# Altium schematic sheet ReceiverBlock.SchDoc
size A4
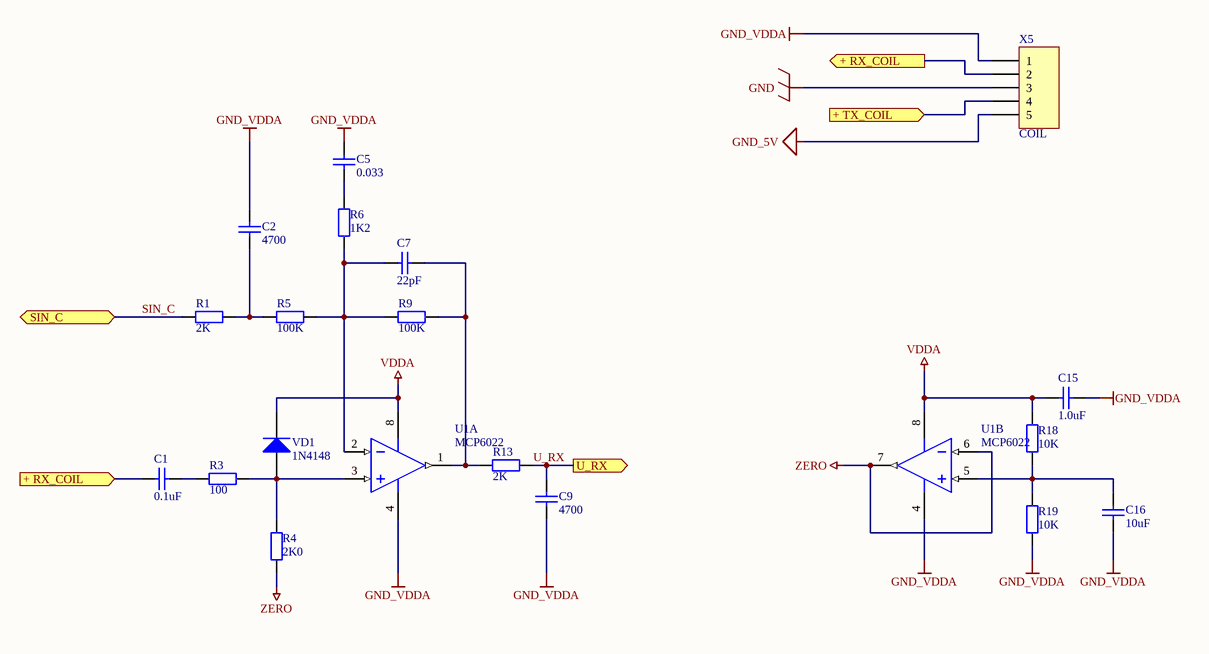
[diagram p0: ReceiverBlock.SchDoc]

## Parts
C1  0.1uF  [1206_SMD_Capacitor]
C2  4700  [1206_SMD_Capacitor]
C5  0.033  [1206_SMD_Capacitor]
C7  22pF  [1206_SMD_Capacitor]
C9  4700  [1206_SMD_Capacitor]
C15  1.0uF  [1206_SMD_Capacitor]
C16  10uF  [1206_SMD_Capacitor]
R1  2K  [1206_SMD_Resistor]
R3  100  [1206_SMD_Resistor]
R4  2K0  [1206_SMD_Resistor]
R5  100K  [1206_SMD_Resistor]
R6  1K2  [1206_SMD_Resistor]
R9  100K  [1206_SMD_Resistor]
R13  2K  [1206_SMD_Resistor]
R18  10K  [1206_SMD_Resistor]
R19  10K  [1206_SMD_Resistor]
U1  MCP6022  [SOIC-SN8_N]  (parts A,B of 2)
VD1  1N4148  [SOD-323]
X5  COIL  [GX16-5]

## Ports
+ RX_COIL (in), + RX_COIL (out), + TX_COIL (in), SIN_C, U_RX (out)

## Nets
GND: X5.3
GND_5V: X5.5
GND_VDDA: C2.1 C5.2 C9.1 C15.2 C16.1 R19.1 U1.4(VSS) X5.1
VDDA: C15.1 R18.2 U1.8(VDD) VD1.2(K)
ZERO: R4.2 U1.6(VINB-) U1.7(VOUTB)
+ RX_COIL: C1.1 X5.2 ; port + RX_COIL
+ TX_COIL: X5.4 ; port + TX_COIL
SIN_C: R1.1 ; port SIN_C
U_RX: C9.2 R13.2 ; port U_RX
NetC1_2: C1.2 R3.2
NetC2_2: C2.2 R1.2 R5.1
NetC5_1: C5.1 R6.2
NetC7_1: C7.1 R9.2 R13.1 U1.1(VOUTA)
NetC7_2: C7.2 R5.2 R6.1 R9.1 U1.2(VINA-)
NetC16_2: C16.2 R18.1 R19.2 U1.5(VINB+)
NetR3_1: R3.1 R4.1 U1.3(VINA+) VD1.1(A)

## Library data of the parts
C1 C2 C5 C7 C9 C15 C16 = Capacitor SMD: Capacitor; Published: 8-Jun-2000; LatestRevisionDate: 17-Jul-2002; LatestRevisionNote: Re-released for DXP Platform.; PackageReference: RAD-0.3; Publisher: Altium Limited
  C1: Value: 0.1uF
  C2 C9: Value: 4700
  C5: Value: 0.033
  C7: Value: 22pF
  C15: Value: 1.0uF
  C16: Value: 10uF
R1 R3-R6 R9 R13 R18 R19 = Resistor
  R1: Published: 8-Jun-2000; LatestRevisionDate: 17-Jul-2002; LatestRevisionNote: Re-released for DXP Platform.; PackageReference: AXIAL-0.4; Publisher: Altium Limited; PackageDescription: Axial Device, Thru-Hole; 2 Leads; 0.4 in Pin Spacing; Value: 2K
  R3: Published: 31-Aug-2014; Publisher: Dmitry Kuzmin; Value: 100
  R4: Published: 8-Jun-2000; LatestRevisionDate: 17-Jul-2002; LatestRevisionNote: Re-released for DXP Platform.; PackageReference: AXIAL-0.4; Publisher: Altium Limited; PackageDescription: Axial Device, Thru-Hole; 2 Leads; 0.4 in Pin Spacing; Value: 2K0
  R5 R9: Published: 31-Aug-2014; Publisher: Dmitry Kuzmin; Value: 100K
  R6: Published: 31-Aug-2014; Publisher: Dmitry Kuzmin; Value: 1K2
  R13: Published: 31-Aug-2014; Publisher: Dmitry Kuzmin; Value: 2K
  R18 R19: Published: 31-Aug-2014; Publisher: Dmitry Kuzmin; Value: 10K
U1 = MCP6022-I/SN: Rail-to-Rail Input/Output, 10 MHz Operational Amplifier, 8-Pin SOIC, Industrial Temperature; Published: 29-Jan-2009; LatestRevisionDate: 02-Dec-2009; LatestRevisionNote: Updated to datasheet revision D, Feb-2009; DatasheetVersion: revD, Feb-2009; PackageVersion: revBB, Aug-2009; PackageReference: SOIC-SN8; Publisher: Altium Limited; PackageDescription: 8-Lead Plastic Small Outline (SN) - Narrow, 3.90mm Body [SOIC]; Supplier 1: Digi-Key; Supplier Part Number 1: MCP6022-I/SN-ND; Supplier 2: Farnell; Supplier Part Number 2: 1439415; Code_JEDEC: MS-012; Code_IPC: SOIC127P600-8; ComponentLink1Description: Datasheet; ComponentLink1URL: http://ww1.microchip.com/downloads/en/DeviceDoc/21685d.pdf; ComponentLink2Description: Packaging Specification; ComponentLink2URL: http://www.microchip.com/stellent/groups/techpub_sg/documents/packagingspec/en012702.pdf; ComponentLink3Description: Microchip.com Home; ComponentLink3URL: http://www.microchip.com/
VD1 = 1N4148: High Conductance Fast Diode; Published: 8-Jun-2000; LatestRevisionDate: 17-Jul-2002; LatestRevisionNote: Re-released for DXP Platform.; DatasheetDocument: 1997; PackageReference: DO-35; Publisher: Altium Limited; Code_JEDEC: DO-204-AH; ComponentLink1Description: Manufacturer Link; ComponentLink1URL: http://www.fairchildsemi.com/; ComponentLink2Description: Datasheet; ComponentLink2URL: http://www.fairchildsemi.com/ds/1N%2F1N4148.pdf
X5 = Jack 5p: Jack, 5 pin; LatestRevisionDate: 17-Jul-2002; LatestRevisionNote: Re-released for DXP Platform.; Publisher: Altium Limited